# EAGLE design AMini3350 (EAGLE 9.5.2)
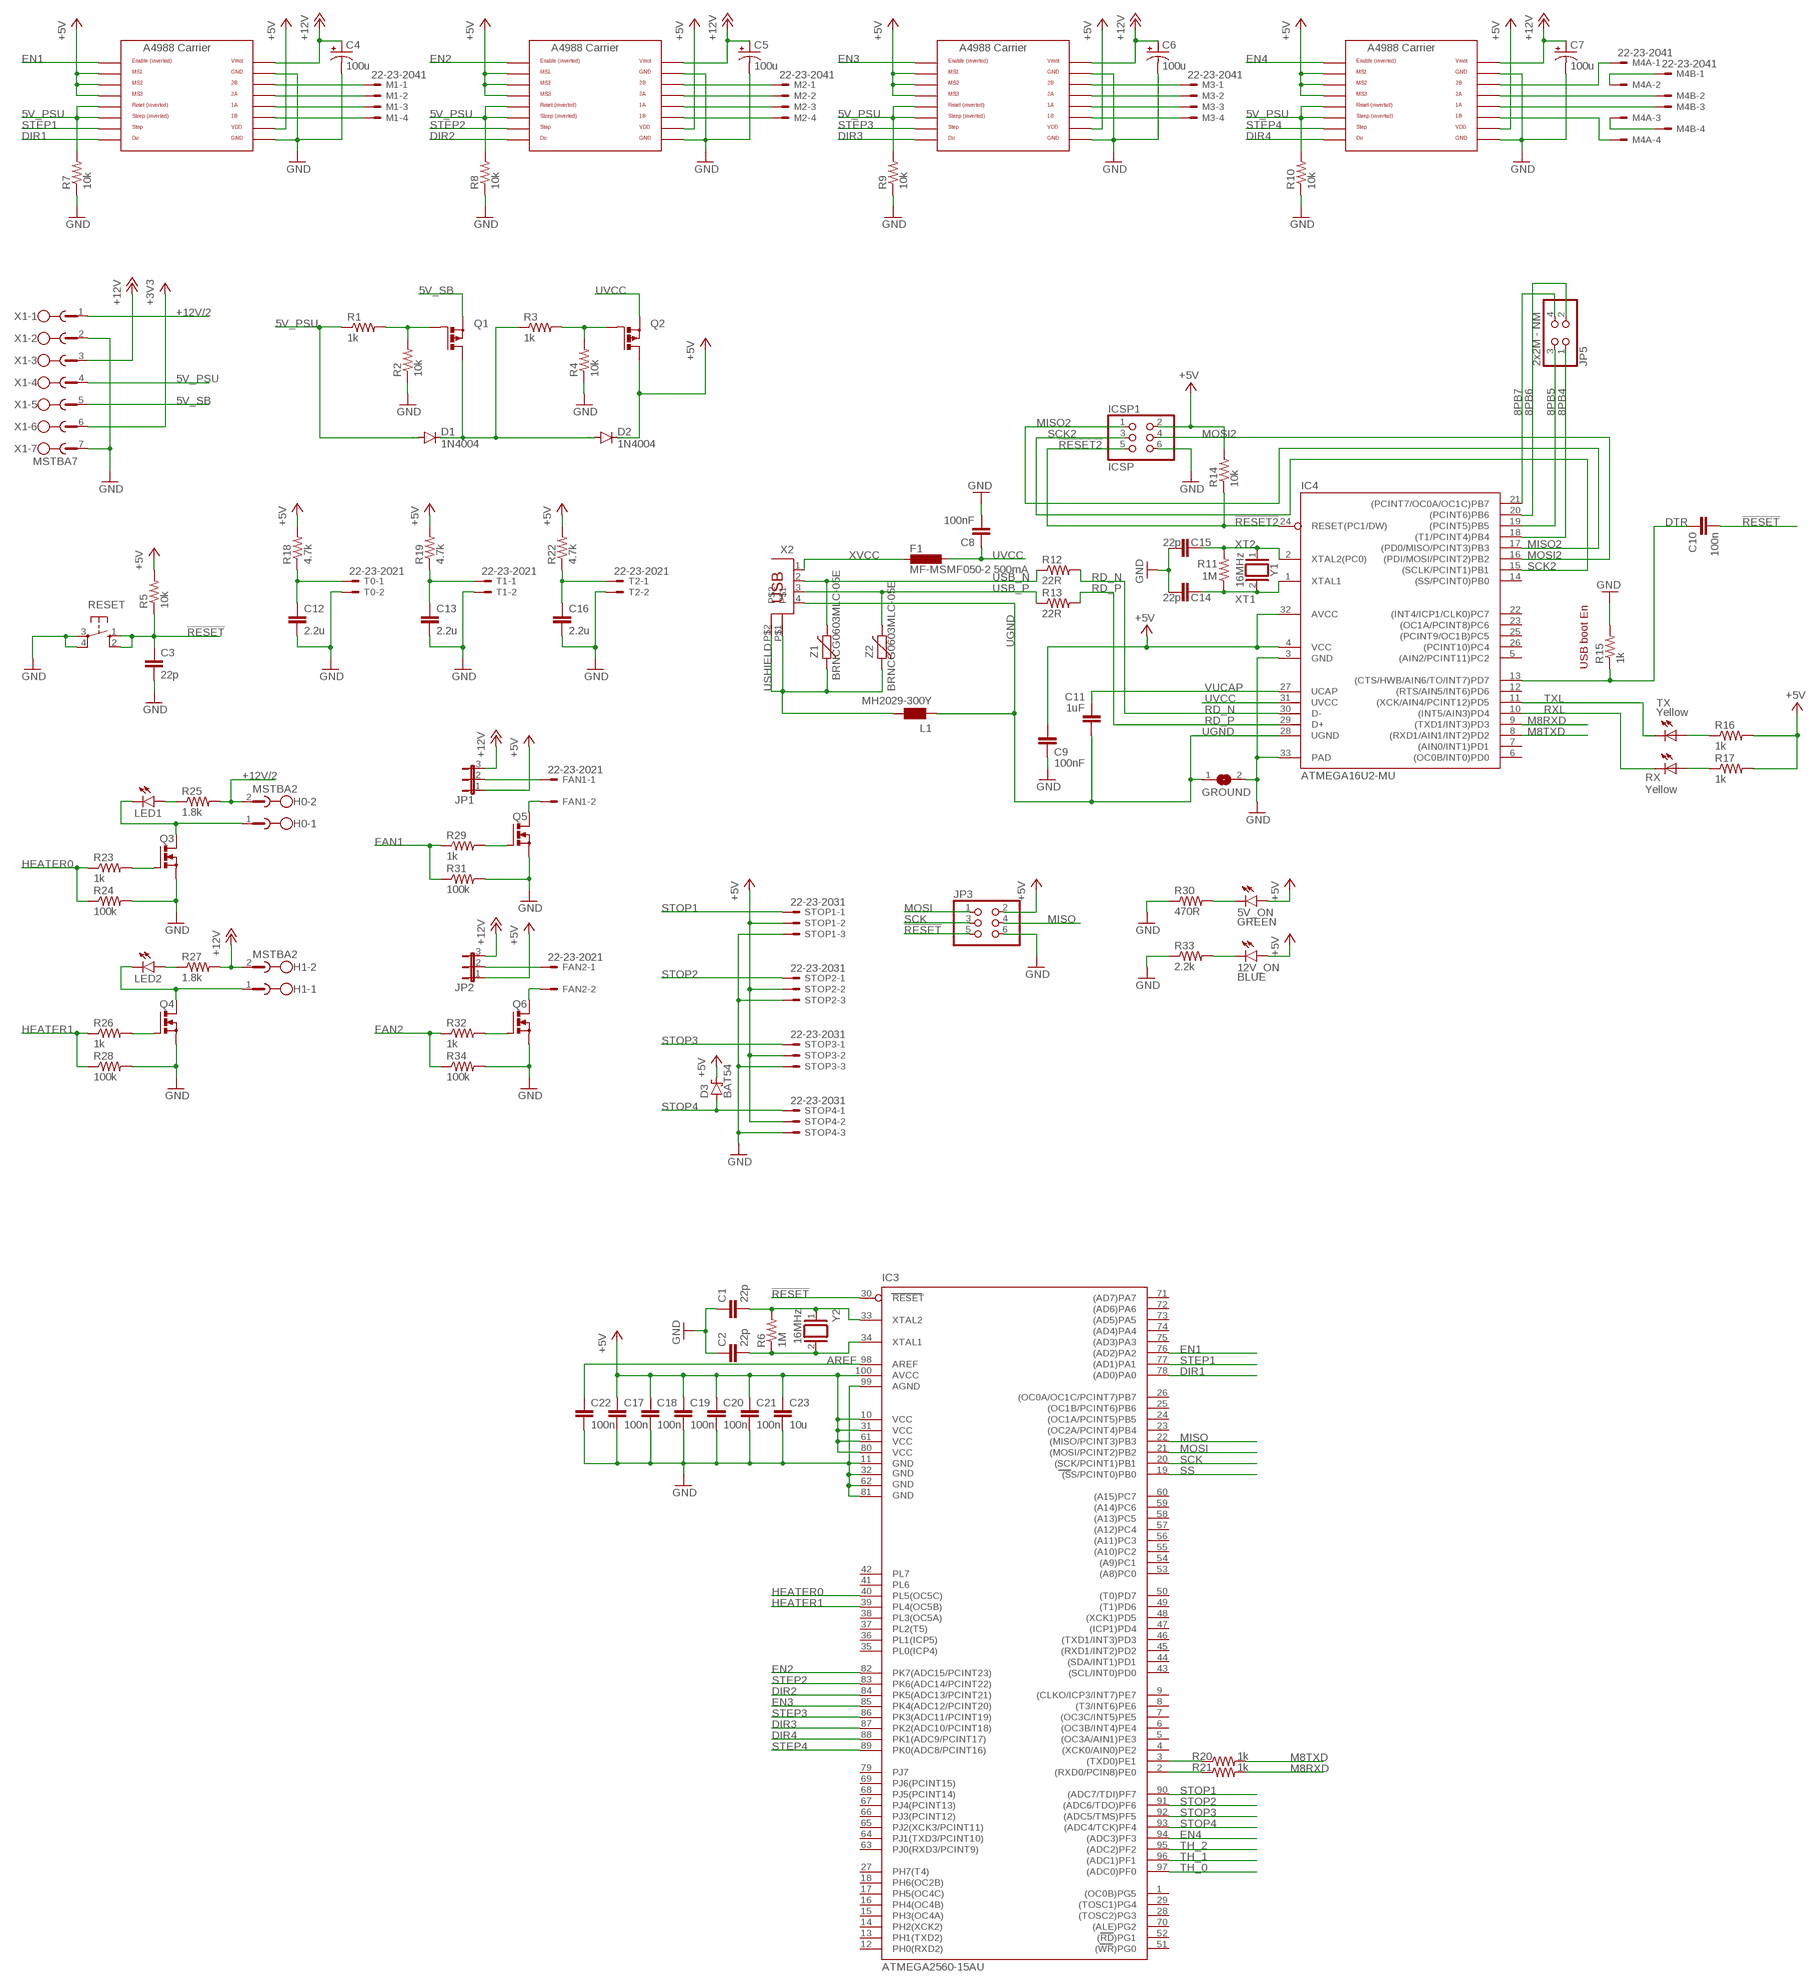
[diagram p0: schematic, sheet 1]

## Parts
5V_ON  GREEN  LEDCHIP-LED0805  [CHIP-LED0805]
12V_ON  BLUE  LEDCHIP-LED0805  [CHIP-LED0805]
C1  22p  C-EUC0603  [C0603]
C2  22p  C-EUC0603  [C0603]
C3  22p  C-EUC0603  [C0603]
C4  100u  CPOL-USD  [PANASONIC_D]
C5  100u  CPOL-USD  [PANASONIC_D]
C6  100u  CPOL-USD  [PANASONIC_D]
C7  100u  CPOL-USD  [PANASONIC_D]
C8  100nF  C-EUC0603  [C0603]
C9  100nF  C-EUC0603  [C0603]
C10  100n  C-EUC0603  [C0603]
C11  1uF  C-EUC0603  [C0603]
C12  2.2u  C-EUC0603  [C0603]
C13  2.2u  C-EUC0603  [C0603]
C14  22p  C-EUC0603  [C0603]
C15  22p  C-EUC0603  [C0603]
C16  2.2u  C-EUC0603  [C0603]
C17  100n  C-EUC0603  [C0603]
C18  100n  C-EUC0603  [C0603]
C19  100n  C-EUC0603  [C0603]
C20  100n  C-EUC0603  [C0603]
C21  100n  C-EUC0603  [C0603]
C22  100n  C-EUC0603  [C0603]
C23  10u  C-EUC0805  [C0805]
D1  1N4004  [DO41-10]
D2  1N4004  [DO41-10]
D3  BAT54  [SOT23]
F1  MF-MSMF050-2 500mA  0002_MF-MSMF050-2  [L1812]
FAN1  22-23-2021  [22-23-2021]
FAN2  22-23-2021  [22-23-2021]
GROUND  SJ  [SJ]
H0  MSTBA2  [MSTBA2]
H1  MSTBA2  [MSTBA2]
IC3  ATMEGA2560-15AU  0023_ATMEGA2560-16AU  [TQFP100]
IC4  ATMEGA16U2-MU  0007_ATMEGA16U2-MUR  [MLF32]
ICSP1  ICSP  0114_PH254-203DF118A00V  [2X03]
JP1  JP2E  [JP2]
JP2  JP2E  [JP2]
JP3  PINHD-2X3  [2X03]
JP5  2x2M - NM  PINHD-2X2  [2X02]
L1  MH2029-300Y  0001_BLM21PG300SN1D_/_MH2029-300Y  [0805]
LED1  LEDCHIP-LED0805  [CHIP-LED0805]
LED2  LEDCHIP-LED0805  [CHIP-LED0805]
M1  22-23-2041  [22-23-2041]
M2  22-23-2041  [22-23-2041]
M3  22-23-2041  [22-23-2041]
M4A  22-23-2041  [22-23-2041]
M4B  22-23-2041  [22-23-2041]
Q1  PMOSFET_PTO220BV  [TO220BV]
Q2  PMOSFET_PTO220BV  [TO220BV]
Q3  PMOSFET_NTO220BV  [TO220BV]
Q4  PMOSFET_NTO220BV  [TO220BV]
Q5  PMOSFET_NTO220BV  [TO220BV]
Q6  PMOSFET_NTO220BV  [TO220BV]
R1  1k  R-US_R0603  [R0603]
R2  10k  R-US_R0603  [R0603]
R3  1k  R-US_R0603  [R0603]
R4  10k  R-US_R0603  [R0603]
R5  10k  R-US_R0603  [R0603]
R6  1M  R-US_R0603  [R0603]
R7  10k  R-US_R0603  [R0603]
R8  10k  R-US_R0603  [R0603]
R9  10k  R-US_R0603  [R0603]
R10  10k  R-US_R0603  [R0603]
R11  1M  R-US_R0603  [R0603]
R12  22R  R-US_R0603  [R0603]
R13  22R  R-US_R0603  [R0603]
R14  10k  R-US_R0603  [R0603]
R15  1k  R-US_R0603  [R0603]
R16  1k  R-US_R0603  [R0603]
R17  1k  R-US_R0603  [R0603]
R18  4.7k  R-US_R0603  [R0603]
R19  4.7k  R-US_R0603  [R0603]
R20  1k  R-US_R0603  [R0603]
R21  1k  R-US_R0603  [R0603]
R22  4.7k  R-US_R0603  [R0603]
R23  1k  R-US_R0603  [R0603]
R24  100k  R-US_R0603  [R0603]
R25  1.8k  R-US_R0603  [R0603]
R26  1k  R-US_R0603  [R0603]
R27  1.8k  R-US_R0603  [R0603]
R28  100k  R-US_R0603  [R0603]
R29  1k  R-US_R0603  [R0603]
R30  470R  R-US_R0603  [R0603]
R31  100k  R-US_R0603  [R0603]
R32  1k  R-US_R0603  [R0603]
R33  2.2k  R-US_R0603  [R0603]
R34  100k  R-US_R0603  [R0603]
RESET  10-XX  [B3F-10XX]
RX  Yellow  0044_KPT-2012YC  [CHIPLED_0805]
STOP1  22-23-2031  [22-23-2031]
STOP2  22-23-2031  [22-23-2031]
STOP3  22-23-2031  [22-23-2031]
STOP4  22-23-2031  [22-23-2031]
T0  22-23-2021  [22-23-2021]
T1  22-23-2021  [22-23-2021]
T2  22-23-2021  [22-23-2021]
TX  Yellow  0044_KPT-2012YC  [CHIPLED_0805]
U$1  A4988BREAKOUT  [A4988BREAKOUT]
U$2  A4988BREAKOUT  [A4988BREAKOUT]
U$3  A4988BREAKOUT  [A4988BREAKOUT]
U$4  A4988BREAKOUT  [A4988BREAKOUT]
X1  MSTBA7  [MSTBA7]
X2  0056_USB-B-S-RA-WT-SPCC  [PN61729]
Y1  16MHz  0019_P011052006_16M  [QS]
Y2  16MHz  0019_P011052006_16M  [QS]
Z1  BRNCG0603MLC-05E  0010_BRNCG0603MLC-05E  [CT/CN0603]
Z2  BRNCG0603MLC-05E  0010_BRNCG0603MLC-05E  [CT/CN0603]

## Nets
1A-1: M1.3 U$1.1A
1A-2: M2.3 U$2.1A
1A-3: M3.3 U$3.1A
1A-4: M4B.3 U$4.1A
1B-1: M1.4 U$1.1B
1B-2: M2.4 U$2.1B
1B-3: M3.4 U$3.1B
1B-4: M4A.4 U$4.1B
2A-1: M1.2 U$1.2A
2A-2: M2.2 U$2.2A
2A-3: M3.2 U$3.2A
2A-4: M4B.2 U$4.2A
2B-1: M1.1 U$1.2B
2B-2: M2.1 U$2.2B
2B-3: M3.1 U$3.2B
2B-4: M4A.1 U$4.2B
5V_PSU: D1.A R1.1 R7.2 R8.2 R9.2 R10.2 U$1.RST U$1.SLP(SLEEP) U$2.RST U$2.SLP(SLEEP) U$3.RST U$3.SLP(SLEEP) U$4.RST U$4.SLP(SLEEP) X1.4
5V_SB: Q1.S X1.5
5V_SB_G: Q1.G R1.2 R2.2
5V_SEL1: D1.C D2.A Q1.D R3.1
8PB4: IC4.18((T1/PCINT4)PB4) JP5.1
8PB5: IC4.19((PCINT5)PB5) JP5.3
8PB6: IC4.20((PCINT6)PB6) JP5.2
8PB7: IC4.21((PCINT7/OC0A/OC1C)PB7) JP5.4
!RESET: C3.1 C10.2 IC3.30(RESET) JP3.5 R5.1 RESET.1(S) RESET.2(S1)
!RESET2: IC4.24(RESET(PC1/DW)) ICSP1.5 R14.1
+3V3: X1.6
+5V: 5V_ON.A 12V_ON.A C9.1 C17.1 C18.1 C19.1 C20.1 C21.1 C23.1 D2.C D3.3(C) IC3.10(VCC) IC3.31(VCC1) IC3.61(VCC2) IC3.80(VCC3) IC3.100(AVCC) IC4.4(VCC) IC4.32(AVCC) ICSP1.2 JP1.1 JP2.1 JP3.2 Q2.D R5.2 R14.2 R16.2 R17.2 R18.2 R19.2 R22.2 STOP1.2 STOP2.2 STOP3.2 STOP4.2 U$1.MS1 U$1.MS2 U$1.MS3 U$1.VDD U$2.MS1 U$2.MS2 U$2.MS3 U$2.VDD U$3.MS1 U$3.MS2 U$3.MS3 U$3.VDD U$4.MS1 U$4.MS2 U$4.MS3 U$4.VDD
+12V: C4.+ C5.+ C6.+ C7.+ H1.2 JP1.3 JP2.3 R27.2 U$1.VMOT U$2.VMOT U$3.VMOT U$4.VMOT X1.3
+12V/2: H0.2 R25.2 X1.1
AB1-4: M4A.3 M4B.4
AB2-4: M4A.2 M4B.1
AREF: C22.1 IC3.98(AREF)
DIR1: IC3.78((AD0)PA0) U$1.DIR
DIR2: IC3.84(PK5(ADC13/PCINT21)) U$2.DIR
DIR3: IC3.87(PK2(ADC10/PCINT18)) U$3.DIR
DIR4: IC3.88(PK1(ADC9/PCINT17)) U$4.DIR
DTR: C10.1 IC4.13((CTS/HWB/AIN6/TO/INT7)PD7) R15.1
EN1: IC3.76((AD2)PA2) U$1.EN
EN2: IC3.82(PK7(ADC15/PCINT23)) U$2.EN
EN3: IC3.85(PK4(ADC12/PCINT20)) U$3.EN
EN4: IC3.94((ADC3)PF3) U$4.EN
FAN1: R29.1 R31.1
FAN1_D: FAN1.2 Q5.D
FAN1_G: Q5.G R29.2
FAN1_V: FAN1.1 JP1.2
FAN2: R32.1 R34.1
FAN2_D: FAN2.2 Q6.D
FAN2_G: Q6.G R32.2
FAN2_V: FAN2.1 JP2.2
GND: C1.1 C2.1 C3.2 C4.- C5.- C6.- C7.- C8.2 C9.2 C12.2 C13.2 C14.2 C15.2 C16.2 C17.2 C18.2 C19.2 C20.2 C21.2 C22.2 C23.2 GROUND.2 IC3.11(GND) IC3.32(GND1) IC3.62(GND2) IC3.81(GND3) IC3.99(AGND) IC4.3(GND) IC4.33(PAD) ICSP1.6 JP3.6 Q3.S Q4.S Q5.S Q6.S R2.1 R4.1 R7.1 R8.1 R9.1 R10.1 R15.2 R24.2 R28.2 R30.1 R31.2 R33.1 R34.2 RESET.3(P) RESET.4(P1) STOP1.3 STOP2.3 STOP3.3 STOP4.3 T0.2 T1.2 T2.2 U$1.GND U$1.GND@0(GND) U$2.GND U$2.GND@0(GND) U$3.GND U$3.GND@0(GND) U$4.GND U$4.GND@0(GND) X1.2 X1.7
H0_D: H0.1 LED1.C Q3.D
H0_G: Q3.G R23.2
H0_LED: LED1.A R25.1
H1_D: H1.1 LED2.C Q4.D
H1_G: Q4.G R26.2
H1_LED: LED2.A R27.1
HEATER0: IC3.40(PL5(OC5C)) R23.1 R24.1
HEATER1: IC3.39(PL4(OC5B)) R26.1 R28.1
M8RXD: IC4.9((TXD1/INT3)PD3) R21.2
M8TXD: IC4.8((RXD1/AIN1/INT2)PD2) R20.2
MISO: IC3.22((MISO/PCINT3)PB3) JP3.4
MISO2: IC4.17((PD0/MISO/PCINT3)PB3) ICSP1.1
MOSI: IC3.21((MOSI/PCINT2)PB2) JP3.1
MOSI2: IC4.16((PDI/MOSI/PCINT2)PB2) ICSP1.4
N$1: 5V_ON.C R30.2
N$2: 12V_ON.C R33.2
RD_N: IC4.30(D-) R12.2
RD_P: IC4.29(D+) R13.2
RX_L: R17.1 RX.A
RXD: IC3.2((RXD0/PCIN8)PE0) R21.1
RXL: IC4.10((INT5/AIN3)PD4) RX.C
SCK: IC3.20((SCK/PCINT1)PB1) JP3.3
SCK2: IC4.15((SCLK/PCINT1)PB1) ICSP1.3
SS: IC3.19((SS/PCINT0)PB0)
STEP1: IC3.77((AD1)PA1) U$1.STEP
STEP2: IC3.83(PK6(ADC14/PCINT22)) U$2.STEP
STEP3: IC3.86(PK3(ADC11/PCINT19)) U$3.STEP
STEP4: IC3.89(PK0(ADC8/PCINT16)) U$4.STEP
STOP1: IC3.90((ADC7/TDI)PF7) STOP1.1
STOP2: IC3.91((ADC6/TDO)PF6) STOP2.1
STOP3: IC3.92((ADC5/TMS)PF5) STOP3.1
STOP4: D3.1(A) IC3.93((ADC4/TCK)PF4) STOP4.1
TH_0: C12.1 IC3.97((ADC0)PF0) R18.1 T0.1
TH_1: C13.1 IC3.96((ADC1)PF1) R19.1 T1.1
TH_2: C16.1 IC3.95((ADC2)PF2) R22.1 T2.1
TX_L: R16.1 TX.A
TXD: IC3.3((TXD0)PE1) R20.1
TXL: IC4.11((XCK/AIN4/PCINT12)PD5) TX.C
UGND: C11.2 GROUND.1 IC4.28(UGND) L1.1 X2.4
USB_N: R12.1 X2.2 Z1.2
USB_P: R13.1 X2.3 Z2.2
USHIELD [gnd]: L1.2 X2.P$1 X2.P$2 Z1.1 Z2.1
UVCC: C8.1 F1.1 IC4.31(UVCC) Q2.S
UVCC_G: Q2.G R3.2 R4.2
VUCAP: C11.1 IC4.27(UCAP)
XT1: C14.1 IC4.1(XTAL1) R11.1 Y1.2
XT2: C15.1 IC4.2(XTAL2(PC0)) R11.2 Y1.1
XTAL1: C2.2 IC3.34(XTAL1) R6.1 Y2.2
XTAL2: C1.2 IC3.33(XTAL2) R6.2 Y2.1
XVCC [power usb]: F1.2 X2.1
Unconnected: IC3.1((OC0B)PG5) IC3.4((XCK0/AIN0)PE2) IC3.5((OC3A/AIN1)PE3) IC3.6((OC3B/INT4)PE4) IC3.7((OC3C/INT5)PE5) IC3.8((T3/INT6)PE6) IC3.9((CLKO/ICP3/INT7)PE7) IC3.12(PH0(RXD2)) IC3.13(PH1(TXD2)) IC3.14(PH2(XCK2)) IC3.15(PH3(OC4A)) IC3.16(PH4(OC4B)) IC3.17(PH5(OC4C)) IC3.18(PH6(OC2B)) IC3.23((OC2A/PCINT4)PB4) IC3.24((OC1A/PCINT5)PB5) IC3.25((OC1B/PCINT6)PB6) IC3.26((OC0A/OC1C/PCINT7)PB7) IC3.27(PH7(T4)) IC3.28((TOSC2)PG3) IC3.29((TOSC1)PG4) IC3.35(PL0(ICP4)) IC3.36(PL1(ICP5)) IC3.37(PL2(T5)) IC3.38(PL3(OC5A)) IC3.41(PL6) IC3.42(PL7) IC3.43((SCL/INT0)PD0) IC3.44((SDA/INT1)PD1) IC3.45((RXD1/INT2)PD2) IC3.46((TXD1/INT3)PD3) IC3.47((ICP1)PD4) IC3.48((XCK1)PD5) IC3.49((T1)PD6) IC3.50((T0)PD7) IC3.51((WR)PG0) IC3.52((RD)PG1) IC3.53((A8)PC0) IC3.54((A9)PC1) IC3.55((A10)PC2) IC3.56((A11)PC3) IC3.57((A12)PC4) IC3.58((A13)PC5) IC3.59((A14)PC6) IC3.60((A15)PC7) IC3.63(PJ0(RXD3/PCINT9)) IC3.64(PJ1(TXD3/PCINT10)) IC3.65(PJ2(XCK3/PCINT11)) IC3.66(PJ3(PCINT12)) IC3.67(PJ4(PCINT13)) IC3.68(PJ5(PCINT14)) IC3.69(PJ6(PCINT15)) IC3.70((ALE)PG2) IC3.71((AD7)PA7) IC3.72((AD6)PA6) IC3.73((AD5)PA5) IC3.74((AD4)PA4) IC3.75((AD3)PA3) IC3.79(PJ7) IC4.5((AIN2/PCINT11)PC2) IC4.6((OC0B/INT0)PD0) IC4.7((AIN0/INT1)PD1) IC4.12((RTS/AIN5/INT6)PD6) IC4.14((SS/PCINT0)PB0) IC4.22((INT4/ICP1/CLK0)PC7) IC4.23((OC1A/PCINT8)PC6) IC4.25((PCINT9/OC1B)PC5) IC4.26((PCINT10)PC4)

## Notes on the sheet
- USB boot En

## Library data of the parts
5V_ON 12V_ON LED1 LED2 = led:LED: LED OSRAM: - CHIPLED LG R971, LG N971, LY N971, LG Q971, LY Q971, LO R971, LY R971 LH N974, LH R974 LS Q976, LO Q976, LY Q976 LO Q996 - Hyper CHIPLED LW Q18S LB Q993, LB Q99A, LB R99A - SideLED LS A670, LO A670, LY A670, LG A670, LP A670 LB A673, LV A673, LT A673, LW A673 LH A674 LY A675 LS A676, LA A676, LO A676, LY A676, LW A676 LS A679, LY A679, LG A679 - Hyper Micro SIDELED® LS Y876, LA Y876, LO Y876, LY Y876 LT Y87S - SmartLED LW L88C, LW L88S LB L89C, LB L89S, LG L890 LS L89K, LO L89K, LY L89K LS L896, LA L896, LO L896, LY L896 - TOPLED LS T670, LO T670, LY T670, LG T670, LP T670 LSG T670, LSP T670, LSY T670, LOP T670, LYG T670 LG T671, LOG T671, LSG T671 LB T673, LV T673, LT T673, LW T673 LH T674 LS T676, LA T676, LO T676, LY T676, LB T676, LH T676, LSB T676, LW T676 LB T67C, LV T67C, LT T67C, LS T67K, LO T67K, LY T67K, LW E67C LS E67B, LA E67B, LO E67B, LY E67B, LB E67C, LV E67C, LT E67C LW T67C LS T679, LY T679, LG T679 LS T770, LO T770, LY T770, LG T770, LP T770 LB T773, LV T773, LT T773, LW T773 LH T774 LS E675, LA E675, LY E675, LS T675 LS T776, LA T776, LO T776, LY T776, LB T776 LHGB T686 LT T68C, LB T68C - Hyper Mini TOPLED® LB M676 - Mini TOPLED Santana® LG M470 LS M47K, LO M47K, LY M47K Source: http://www.osram.convergy.de LUXEON: - LUMILED® LXK2-PW12-R00, LXK2-PW12-S00, LXK2-PW14-U00, LXK2-PW14-V00 LXK2-PM12-R00, LXK2-PM12-S00, LXK2-PM14-U00 LXK2-PE12-Q00, LXK2-PE12-R00, LXK2-PE12-S00, LXK2-PE14-T00, LXK2-PE14-U00 LXK2-PB12-K00, LXK2-PB12-L00, LXK2-PB12-M00, LXK2-PB14-N00, LXK2-PB14-P00, LXK2-PB14-Q00 LXK2-PR12-L00, LXK2-PR12-M00, LXK2-PR14-Q00, LXK2-PR14-R00 LXK2-PD12-Q00, LXK2-PD12-R00, LXK2-PD12-S00 LXK2-PH12-R00, LXK2-PH12-S00 LXK2-PL12-P00, LXK2-PL12-Q00, LXK2-PL12-R00 Source: www.luxeon.com KINGBRIGHT: KA-3528ASYC Source: www.kingbright.com
C1-C3 C8-C23 = rcl:C-EU: CAPACITOR, European symbol; SPICEPREFIX: C
C4-C7 = rcl:CPOL-US: POLARIZED CAPACITOR, American symbol; SPICEPREFIX: C
D1 D2 = diode:1N4004: DIODE general purpose rectifier, 1 A
D3 = diode:BAT54: Schottky Diodes Source: Fairchild .. BAT54.pdf
F1 = Protezione:0002_MF-MSMF050-2: 500 mA Multifuse � Polyfuse; MONTHLY_USAGE: _____; PART_NUMBER: MF-MSMF050-2; PRICE: _____; SUPPLIER: _____; TYPE: Protezione
FAN1 FAN2 T0 T1 T2 = con-molex:22-23-2021: .100" (2.54mm) Center Header - 2 Pin; MF: MOLEX; MPN: 22-23-2021; OC_FARNELL: 1462926; OC_NEWARK: 25C3832
GROUND = jumper:SJ: SMD solder JUMPER
H0 H1 = con-phoenix-508:MSTBA2: PHOENIX; MF: FARNELL; MPN: 1757242; OC_FARNELL: 3705171; OC_NEWARK: 71C4161
IC3 = IntegratedCircuits:0023_ATMEGA2560-16AU: 8-bit Microcontroller with 256K Bytes In-System Programmable Flash - ATMEGA2560-16AU; CASE: TQFP100_14x14; MONTHLY_USAGE: _____; PART_NUMBER: ATMEGA2560-16AU; PRICE: _____; SUPPLIER: _____; TYPE: Circuito_Integrato
IC4 = IntegratedCircuits:0007_ATMEGA16U2-MUR: 8-bit Microcontroller with 16K Bytes of ISP Flash and USB Controller ATMEGA16U2-MUR; CASE: QFN32_5x5; MONTHLY_USAGE: _____; PART_NUMBER: ATMEGA16U2-MUR; PRICE: _____; SUPPLIER: _____; TYPE: Circuito_Integrato
ICSP1 = Connettori:0114_PH254-203DF118A00V: 3x2 M V h 8,5 mm p2,54; MONTHLY_USAGE: _____; PART_NUMBER: PH254-203DF118A00V; PRICE: _____; SUPPLIER: _____; TYPE: Connettori
JP1 JP2 = jumper:JP2E: JUMPER
JP3 = pinhead:PINHD-2X3: PIN HEADER
JP5 = SmartPrj:PINHD-2X2: PIN HEADER
L1 = Protezione:0001_BLM21PG300SN1D_/_MH2029-300Y: BLM21; MONTHLY_USAGE: _____; PART_NUMBER: BLM21PG300SN1D_/_MH2029-300Y; PRICE: _____; SUPPLIER: _____; TYPE: Protezione
M1-M3 M4A M4B = con-molex:22-23-2041: .100" (2.54mm) Center Header - 4 Pin; MF: MOLEX; MPN: 22-23-2041; OC_FARNELL: 1462920; OC_NEWARK: 38C0355
Q1 Q2 = transistor-power:PMOSFET_P: Power MOSFET P-Channel
Q3-Q6 = transistor-power:PMOSFET_N: Power MOSFET N-Channel
R1-R34 = rcl:R-US_: RESISTOR, American symbol; SPICEPREFIX: R
RESET = switch-omron:10-XX: OMRON SWITCH; MPN: B3F-1000; OC_FARNELL: 176432; OC_NEWARK: 36M3542
RX TX = Opto:0044_KPT-2012YC: LED YELLOW - SMD - 0805; MONTHLY_USAGE: _____; PART_NUMBER: KPT-2012YC; PRICE: _____; SUPPLIER: _____; TYPE: Opto
STOP1-STOP4 = con-molex:22-23-2031: .100" (2.54mm) Center Header - 3 Pin; MF: MOLEX; MPN: 22-23-2031; OC_FARNELL: 1462950; OC_NEWARK: 30C0862
U$1-U$4 = RepRapjr:A4988BREAKOUT
X1 = con-phoenix-508:MSTBA7: PHOENIX; OC_FARNELL: unknown; OC_NEWARK: unknown
X2 = Connettori:0056_USB-B-S-RA-WT-SPCC: USB - B; MONTHLY_USAGE: _____; PART_NUMBER: USB-B-S-RA-WT-SPCC; PRICE: _____; SUPPLIER: _____; TYPE: Connettori
Y1 Y2 = Cristalli:0019_P011052006_16M: 16MHz THT; PART_NUMBER: P011052006 16M/FTX16M20S; TYPE: Cristalli
Z1 Z2 = Protezione:0010_BRNCG0603MLC-05E: CG0603MLC-05E; MONTHLY_USAGE: _____; PART_NUMBER: BRNCG0603MLC-05E; PRICE: _____; SUPPLIER: _____; TYPE: Protezione

## Net classes
2 gnd: width 0.305 mm, drill 0.406 mm, clearance 0.203 mm
3 power usb: width 0.2 mm, drill 0.406 mm, clearance 0.203 mm

## Board
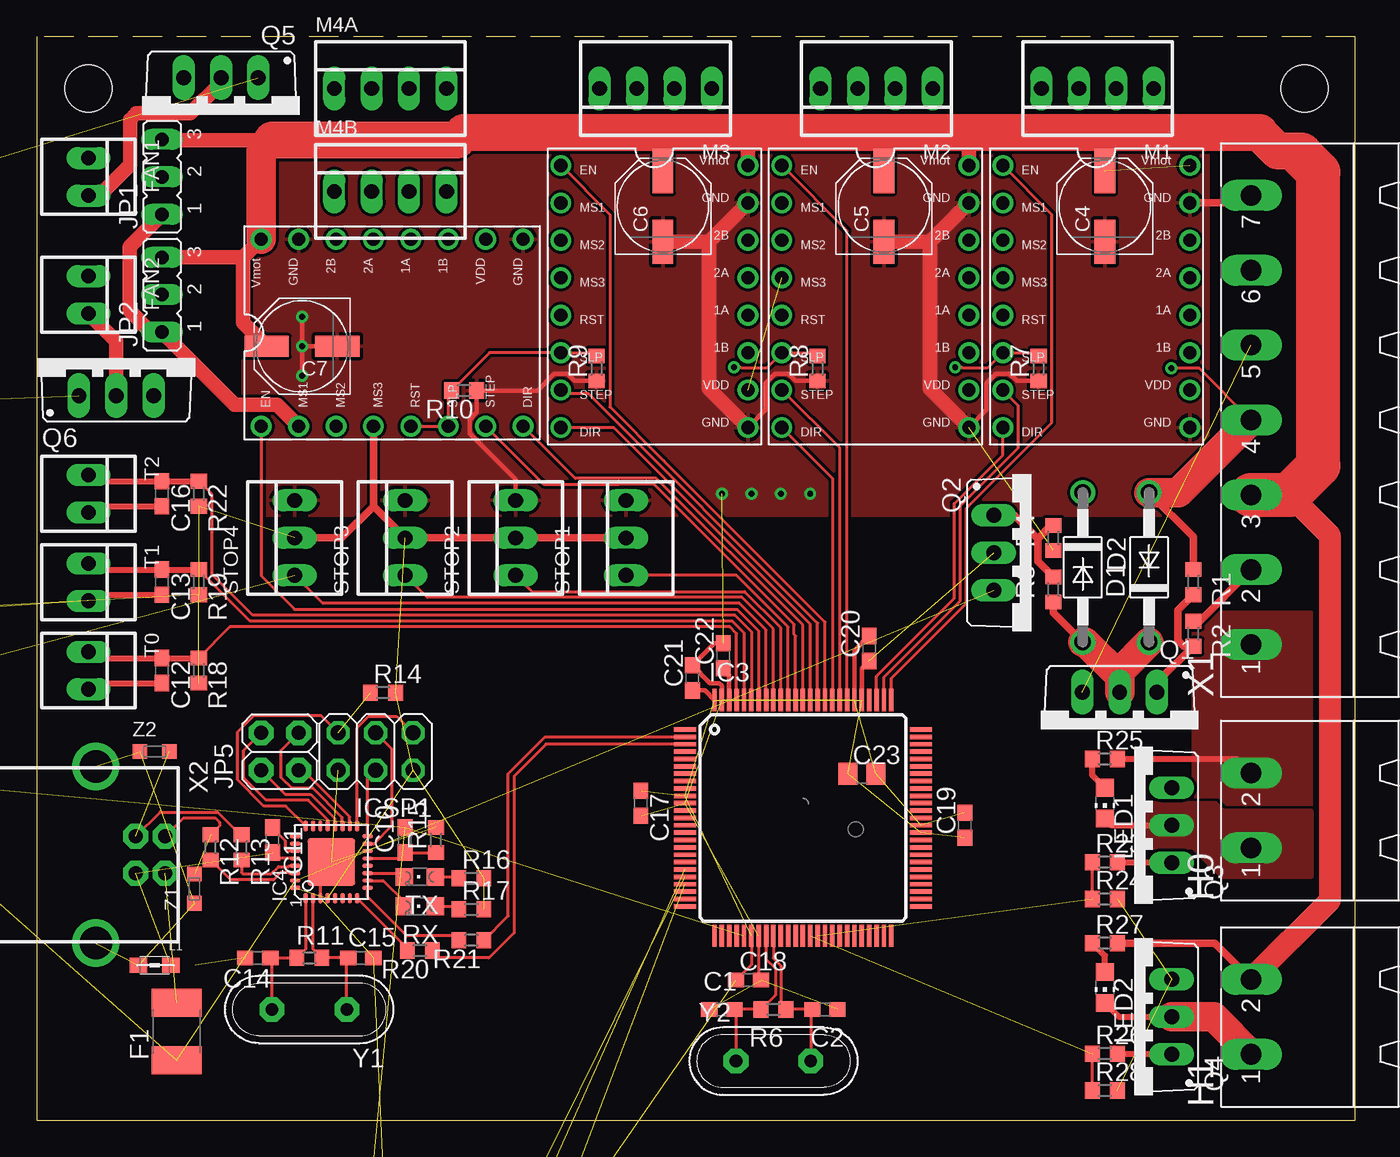
[diagram p1: board, top side]
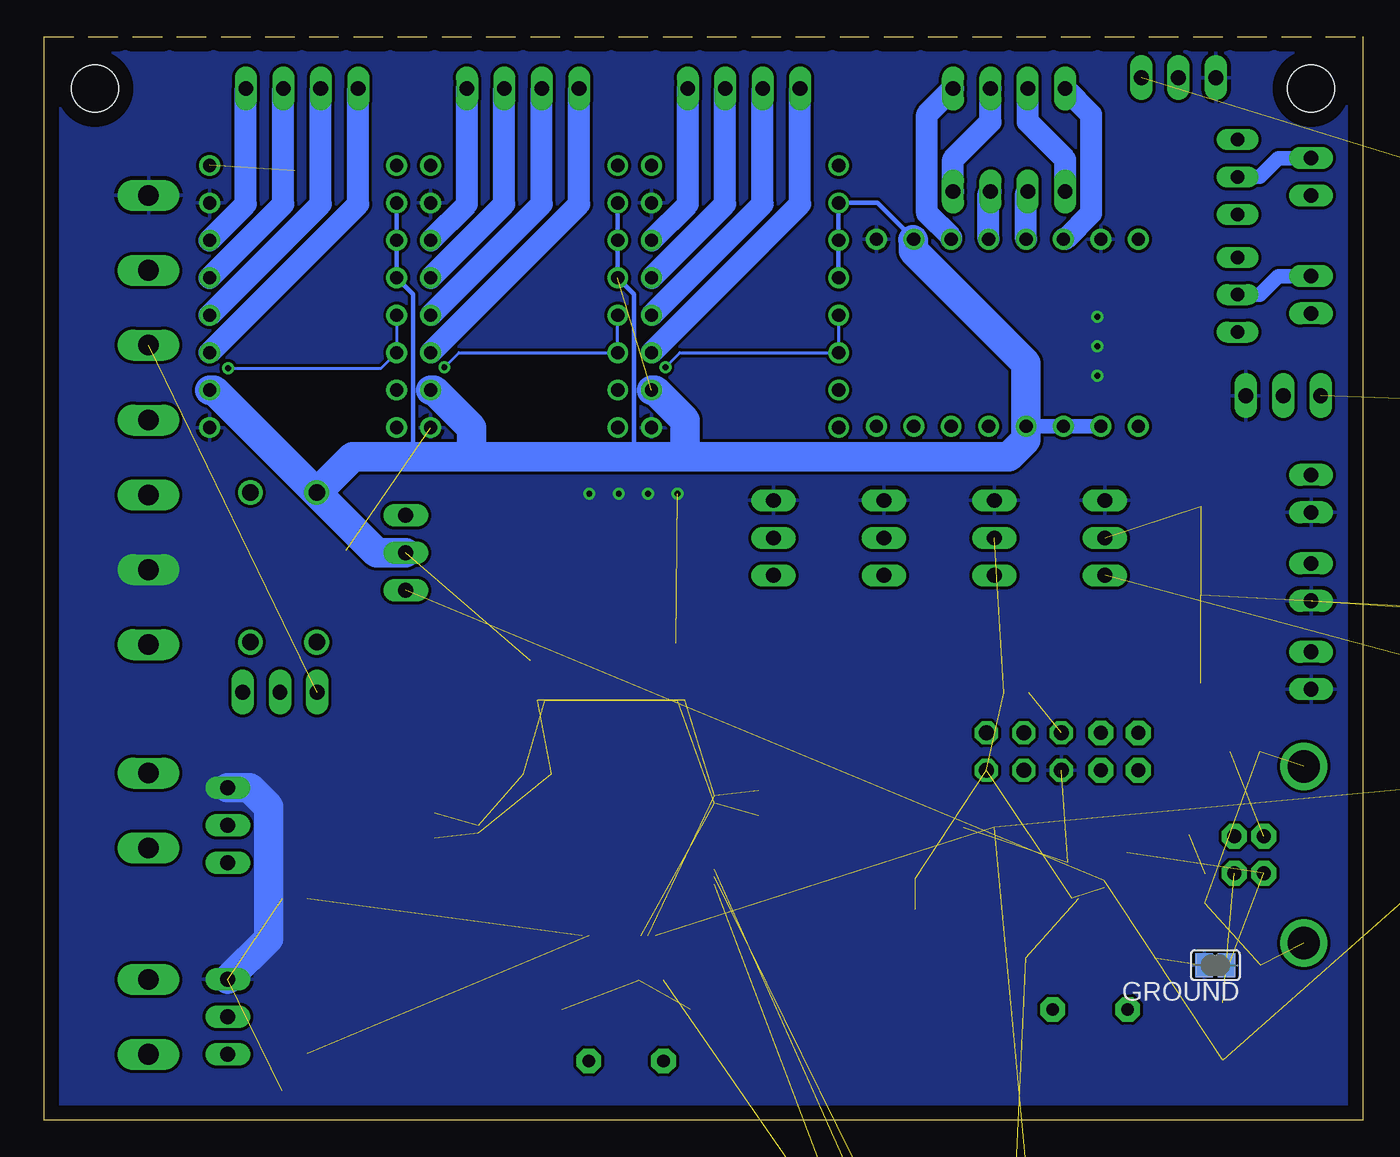
[diagram p2: board, bottom side, seen from below]

Size 89.5 x 73.5 mm. Coordinates in mm from the lower left corner, seen from the top.
Outline: 0,0 89.5,0 89.5,73.5 0,73.5 0,0
Copper layers (1*16): Top 0.035mm / dielectric 1.5mm / Bottom 0.035mm
Design rules "default *": minimum track width 0.2mm, minimum drill 0.4mm, track to track 0.2mm, track to pad 0.25mm, pad to pad 0.25mm, via to via 0.2mm, smd to smd 0.2mm, copper to edge 1mm, drill to drill 0.2mm, minimum pad ring 10mil, minimum via ring 8mil, stop-mask expansion 4mil, vias tented up to drill 16mil, thermal gap 10mil
Holes 3.2 mm at 86.05,70 3.5,70
tRestrict: area 83,67 to 89,73; area 0.5,67 to 6.5,73

### Footprints (pad centres in the part's own frame; a part is rotated, then mirrored left to right if it is on the bottom)
CHIP-LED0805 = smd 1.2 x 1.2: A 0,-1.05; C 0,1.05
C0603 = smd 1.1 x 1: 1 -0.85,0; 2 0.85,0
PANASONIC_D = smd 3 x 1.4: + 2.4,0; - -2.4,0
C0805 = smd 1.3 x 1.5: 1 -0.95,0; 2 0.95,0
DO41-10 = drill 1.118: A 5.08,0; C -5.08,0
SOT23 = smd 1 x 1.4: 1 -0.95,-1.1; 2 0.95,-1.1; 3 0,1.1
L1812 = smd 1.9 x 3.4: 1 -1.95,0; 2 1.95,0
22-23-2021 = drill 1 long: 1 -1.27,0; 2 1.27,0
SJ = smd 1.168 x 1.6: 1 -0.762,0; 2 0.762,0
MSTBA2 = drill 1.397 long: 1 -2.54,5.08; 2 2.54,5.08
TQFP100 = smd 1.5 x 0.3: 1 -8,6; 2 -8,5.5; 3 -8,5; 4 -8,4.5; 5 -8,4; 6 -8,3.5; 7 -8,3; 8 -8,2.5; 9 -8,2; 10 -8,1.5; 11 -8,1; 12 -8,0.5; 13 -8,0; 14 -8,-0.5; 15 -8,-1; 16 -8,-1.5; 17 -8,-2; 18 -8,-2.5; 19 -8,-3; 20 -8,-3.5; 21 -8,-4; 22 -8,-4.5; 23 -8,-5; 24 -8,-5.5; 25 -8,-6; 51 8,-6; 52 8,-5.5; 53 8,-5; 54 8,-4.5; 55 8,-4; 56 8,-3.5; 57 8,-3; 58 8,-2.5; 59 8,-2; 60 8,-1.5; 61 8,-1; 62 8,-0.5; 63 8,0; 64 8,0.5; 65 8,1; 66 8,1.5; 67 8,2; 68 8,2.5; 69 8,3; 70 8,3.5; 71 8,4; 72 8,4.5; 73 8,5; 74 8,5.5; 75 8,6 | smd 0.3 x 1.5: 26 -6,-8; 27 -5.5,-8; 28 -5,-8; 29 -4.5,-8; 30 -4,-8; 31 -3.5,-8; 32 -3,-8; 33 -2.5,-8; 34 -2,-8; 35 -1.5,-8; 36 -1,-8; 37 -0.5,-8; 38 0,-8; 39 0.5,-8; 40 1,-8; 41 1.5,-8; 42 2,-8; 43 2.5,-8; 44 3,-8; 45 3.5,-8; 46 4,-8; 47 4.5,-8; 48 5,-8; 49 5.5,-8; 50 6,-8; 76 6,8; 77 5.5,8; 78 5,8; 79 4.5,8; 80 4,8; 81 3.5,8; 82 3,8; 83 2.5,8; 84 2,8; 85 1.5,8; 86 1,8; 87 0.5,8; 88 0,8; 89 -0.5,8; 90 -1,8; 91 -1.5,8; 92 -2,8; 93 -2.5,8; 94 -3,8; 95 -3.5,8; 96 -4,8; 97 -4.5,8; 98 -5,8; 99 -5.5,8; 100 -6,8
MLF32 = smd 0.7 x 0.28: 1 -2.45,1.75; 2 -2.45,1.25; 3 -2.45,0.75; 4 -2.45,0.25; 5 -2.45,-0.25; 6 -2.45,-0.75; 7 -2.45,-1.25; 8 -2.45,-1.75; 17 2.45,-1.75; 18 2.45,-1.25; 19 2.45,-0.75; 20 2.45,-0.25; 21 2.45,0.25; 22 2.45,0.75; 23 2.45,1.25; 24 2.45,1.75 | smd 0.28 x 0.7: 9 -1.75,-2.45; 10 -1.25,-2.45; 11 -0.75,-2.45; 12 -0.25,-2.45; 13 0.25,-2.45; 14 0.75,-2.45; 15 1.25,-2.45; 16 1.75,-2.45; 25 1.75,2.45; 26 1.25,2.45; 27 0.75,2.45; 28 0.25,2.45; 29 -0.25,2.45; 30 -0.75,2.45; 31 -1.25,2.45; 32 -1.75,2.45 | smd 3.254 x 3.254: 33 0,0
2X03 = drill 1.016 pad 1.55 octagon: 1 -2.54,-1.27; 2 -2.54,1.27; 3 0,-1.27; 4 0,1.27; 5 2.54,-1.27; 6 2.54,1.27
JP2 = drill 0.914 long: 1 -2.54,0; 2 0,0; 3 2.54,0
2X03' = drill 1.016 octagon: 1 -2.54,-1.27; 2 -2.54,1.27; 3 0,-1.27; 4 0,1.27; 5 2.54,-1.27; 6 2.54,1.27
2X02 = drill 0.95 pad 1.676 octagon: 1 -1.27,-1.27; 2 -1.27,1.27; 3 1.27,-1.27; 4 1.27,1.27
0805 = smd 1.2 x 1: 1 -1.1,0; 2 1.1,0
22-23-2041 = drill 1 long: 1 -3.81,0; 2 -1.27,0; 3 1.27,0; 4 3.81,0
TO220BV = drill 1.016 long: D 0,-2.54; G -2.54,-2.54; S 2.54,-2.54
R0603 = smd 1 x 1.1: 1 -0.85,0; 2 0.85,0
B3F-10XX = drill 1.016 long: 1 -3.251,2.261; 2 3.251,2.261; 3 -3.251,-2.261; 4 3.251,-2.261
CHIPLED_0805 = smd 1.2 x 1.2: A 0,-1.05; C 0,1.05
22-23-2031 = drill 1 long: 1 -2.54,0; 2 0,0; 3 2.54,0
A4988BREAKOUT = drill 0.9: 1A 8.89,1.27; 1B 11.43,1.27; 2A 6.35,1.27; 2B 3.81,1.27; DIR 16.51,-11.43; EN -1.27,-11.43; GND 16.51,1.27; GND@0 1.27,1.27; MS1 1.27,-11.43; MS2 3.81,-11.43; MS3 6.35,-11.43; RST 8.89,-11.43; SLP 11.43,-11.43; STEP 13.97,-11.43; VDD 13.97,1.27; VMOT -1.27,1.27
MSTBA7 = drill 1.397 long: 1 -15.24,5.08; 2 -10.16,5.08; 3 -5.08,5.08; 4 0,5.08; 5 5.08,5.08; 6 10.16,5.08; 7 15.24,5.08
PN61729 = drill 0.95 pad 1.676 octagon: 1 1.25,4.71; 2 -1.25,4.71; 3 -1.25,2.71; 4 1.25,2.71 | drill 2.2: P$1 -6,0; P$2 6,0
QS = drill 0.85 pad 1.676 octagon: 1 -2.54,0; 2 2.54,0
CT/CN0603 = smd 1 x 1: 1 -1,0; 2 1,0

### Placement (x,y rotation side)
5V_ON  -110.5,-21.5 0 top  (outside the outline)
12V_ON  -110.5,-35.5 0 top  (outside the outline)
C1  46.5,7.5 0 top
C2  53.5,7.5 180 top
C3  23,-10.5 0 top  (outside the outline)
C4  72.5,62 90 top
C5  57.5,62 90 top
C6  42.5,62 90 top
C7  18,52.5 180 top
C8  -23,33.5 0 top  (outside the outline)
C9  -28,33.5 0 top  (outside the outline)
C10  25,19 90 top
C11  16,19 270 top
C12  8.5,30.5 270 top
C13  8.5,36.5 270 top
C14  15,11 180 top
C15  22,11 0 top
C16  8.5,42.5 270 top
C17  41,21.5 270 top
C18  48.3,9.5 0 top
C19  63,20 90 top
C20  56.5,32 90 top
C21  44.5,30 90 top
C22  46.6,31.5 90 top
C23  56,23.5 0 top
D1  75.5,37.5 90 top
D2  71,37.5 270 top
D3  -50.5,19.5 0 top  (outside the outline)
F1  9.5,6 90 top
FAN1  3.5,64 270 top
FAN2  3.5,56 270 top
GROUND  10,10.5 180 bottom
H0  87.5,21 90 top
H1  87.5,7 90 top
IC3  52,20.5 0 top
IC4  20,17.5 90 top
ICSP1  23,25 180 top
JP1  8.5,64 90 top
JP2  8.5,56 90 top
JP3  [2X03']  31,-15 270 top  (outside the outline)
JP5  16.5,25 90 top
L1  8,10.5 180 top
LED1  72.5,21.5 180 top
LED2  72.5,9 180 top
M1  72,70 180 top
M2  57,70 180 top
M3  42,70 180 top
M4A  24,70 0 top
M4B  24,63 0 top
Q1  73.5,26.5 180 top
Q2  67.5,38.5 270 top
Q3  74.5,20 90 top
Q4  74.5,7 90 top
Q5  12.5,68.2 180 top
Q6  5.4,51.7 0 top
R1  78.5,36.5 270 top
R2  78.5,33 270 top
R3  69,36 90 top
R4  69,39.5 90 top
R5  -57,27.5 0 top  (outside the outline)
R6  50,7.5 180 top
R7  68,51 90 top
R8  53,51 90 top
R9  38,51 90 top
R10  29,49.5 180 top
R11  18.5,11 0 top
R12  11.8,18.5 270 top
R13  13.9,18.5 270 top
R14  23.5,29 0 top
R15  27.1,19 90 top
R16  29.5,16.4 0 top
R17  29.5,14.3 0 top
R18  11,30.5 270 top
R19  11,36.5 270 top
R20  26,11.5 180 top
R21  29.5,12.2 180 top
R22  11,42.5 270 top
R23  72.5,17.5 0 top
R24  72.5,15 0 top
R25  72.5,24.5 0 top
R26  72.5,4.5 0 top
R27  72.5,12 0 top
R28  72.5,2 0 top
R29  -64.5,46.5 0 top  (outside the outline)
R30  -112,-26.5 0 top  (outside the outline)
R31  -45.5,41.5 0 top  (outside the outline)
R32  -69.5,46.5 0 top  (outside the outline)
R33  -112,-40 0 top  (outside the outline)
R34  -52,41.5 0 top  (outside the outline)
RESET  22.5,-15 0 top  (outside the outline)
RX  26,14.5 90 top
STOP1  40,39.5 90 top
STOP2  32.5,39.5 90 top
STOP3  25,39.5 90 top
STOP4  17.5,39.5 90 top
T0  3.5,30.5 270 top
T1  3.5,36.5 270 top
T2  3.5,42.5 270 top
TX  26,16.5 90 top
U$1  77,63.5 270 top
U$2  62,63.5 270 top
U$3  47,63.5 270 top
U$4  16.5,58.5 0 top
X1  87.5,47.5 90 top
X2  4,18 270 top
Y1  18.5,7.5 180 top
Y2  50,4 0 top
Z1  10.7,15.7 90 top
Z2  8,25 0 top

### Tracks (layer width: path | path; a pad name or v marks a point on that pad's centre or on a via)
1A-1
  Bottom 1.5: U$1.1A 70.73,62.15 M1.3
1A-2
  Bottom 1.5: U$2.1A 55.73,62.15 M2.3
1A-3
  Bottom 1.5: U$3.1A 40.73,62.15 M3.3
1A-4
  Bottom 1.5: U$4.1A 25.39,62.88 M4B.3
1B-1
  Bottom 1.5: U$1.1B 68.19,62.15 M1.4
1B-2
  Bottom 1.5: U$2.1B 53.19,62.15 M2.4
1B-3
  Bottom 1.5: U$3.1B 38.19,62.15 M3.4
1B-4
  Bottom 1.5: U$4.1B 27.93,59.88 29.56,61.52 29.56,68.25 M4A.4
2A-1
  Bottom 1.5: U$1.2A 73.27,62.15 M1.2
2A-2
  Bottom 1.5: U$2.2A 58.27,62.15 M2.2
2A-3
  Bottom 1.5: U$3.2A 43.27,62.15 M3.2
2A-4
  Bottom 1.5: U$4.2A 22.85,62.88 M4B.2
2B-1
  Bottom 1.5: U$1.2B 75.81,62.15 M1.1
2B-2
  Bottom 1.5: U$2.2B 60.81,62.15 M2.1
2B-3
  Bottom 1.5: U$3.2B 45.81,62.15 M3.1
2B-4
  Bottom 1.5: M4A.1 18.44,68.25 18.44,61.52 20.18,59.77 U$4.2B
5V_PSU  (via drill 0.4)
  Top 0.2: v47.34,51.09 47.76,51.09 47.83,51.02 49.52,51.02 U$2.SLP 52.78,52.07 R8.2 | v62.34,51.09 62.76,51.09 62.83,51.02 64.52,51.02 U$1.SLP 67.78,52.07 R7.2 | U$4.RST U$4.SLP 27.93,49.28 R10.2 30.72,52.07 U$3.SLP 37.78,52.07 R9.2 | X1.4 78.9,51.02 v77,51.02
  Top 0.5: R1.1 78.5,39.58 D1.A
  Top 2: X1.4 77.5,42.58 D1.A
  Bottom 0.2: U$3.RST U$3.SLP 46.35,52.07 v47.34,51.09 | U$2.RST U$2.SLP 61.35,52.07 v62.34,51.09 | U$1.RST U$1.SLP 66.62,51.02 v77,51.02
5V_SB  (1 unrouted)
5V_SB_G
  Top 0.5: Q1.G 76.04,29.69 R2.2 77.85,32.15 77.45,32.55 77.45,34.6 R1.2
5V_SEL1
  Top 0.5: D2.A 69,34.42 R3.1
  Top 2: Q1.D 73.5,30.11 | D2.A 71.19,32.42 73.5,30.11 | D1.C 73.5,30.42 73.5,30.11
8PB4
  Top 0.2: IC4.18 21.24,20.58 18.09,23.73 JP5.1
8PB5
  Top 0.2: IC4.19 20.74,20.51 18.75,22.5 17.32,22.5 16.58,23.24 16.58,25.08 JP5.3
8PB6
  Top 0.2: IC4.20 20.24,20.45 18.59,22.1 16.86,22.1 JP5.2
8PB7
  Top 0.2: JP5.4 14.04,25.08 14.04,23.24 15.58,21.7 18.42,21.7 19.74,20.38 IC4.21
!RESET  (6 unrouted)
!RESET2  (1 unrouted)
  Top 0.2: IC4.24 16.9,21.3 15.41,21.3 13.64,23.07 13.64,26.36 14.74,27.46 19.27,27.46 ICSP1.5
+5V  (24 unrouted)
  Top 0.2: IC3.31 48.5,10.55 C18.1
  Top 0.3: IC3.100 45.35,29.15 C21.1 | IC3.80 56,30.65 C20.1
  Top 0.5: U$4.MS3 22.85,41.65 | 22.85,41.65 STOP3.2 STOP2.2 STOP1.2 | 22.85,41.65 20.7,39.5 STOP4.2
  Top 1: JP1.1 6.3,59.26 6.3,54.9 7.74,53.46 JP2.1 13.44,48.52 16.32,48.52 U$4.MS1
  Bottom 0.3: U$3.MS3 U$3.MS2 U$3.MS1 32.93,62.23 U$4.VDD | U$2.MS1 U$2.MS2 U$2.MS3 49.47,56.05 49.47,45.03 49.5,45 | U$1.MS1 U$1.MS2 U$1.MS3 64.47,56.05 64.47,45.03 64.5,45
  Bottom 1: U$4.VDD 30.5,59.74 30.5,59.7 | U$4.MS3 U$4.MS2 U$4.MS1
  Bottom 2: D2.C 77.95,49.53 U$1.VDD | D2.C 68.58,45 64.5,45 60.5,45 | 60.5,45 49.5,45 24,45 22.85,46.15 U$4.MS3 22.85,51.35 30.5,59 30.5,59.7 30.52,59.72 | 46,45.5 46,47.48 48.05,49.53 U$3.VDD | 60.5,45 60.5,46.98 63.05,49.53 U$2.VDD | Q2.D 66.92,38.5 D2.C
+12V  (1 unrouted)
  Top 0.5: R27.2 79.96,12 H1.2
  Top 1: 16,66.5 8.54,66.5 JP1.3 | JP2.3 14,58.54 | 14,58.54 U$4.VMOT | C6.+ 42.5,66.99 | U$3.VMOT 48.27,66.76 48.5,66.99 | C5.+ 57.5,66.99 | U$2.VMOT 63.27,66.26 64,66.99 | C4.+ 72.5,65.99 73.5,66.99 | C7.+ 14,54.1 14,58.54
  Top 1.5: 85.02,42.42 87.75,39.69 87.75,14.87 H1.2
  Top 2: U$4.VMOT 15.23,65.73 16,66.5
  Top 2.5: 85.8,65.5 85.55,65.75 84.24,65.75 83,66.99 73.5,66.99 64,66.99 57.5,66.99 48.5,66.99 42.5,66.99 28.99,66.99 28.5,66.5 16,66.5
  Top 3: X1.3 85.02,42.42 87,44.4 87,64.3 85.8,65.5
+12V/2
  Top 0.4: R25.2 81.46,24.5 H0.2
  pour Top (rank 3, no thermals): 78.5,34 78.5,34.5 86.5,34.5 86.5,21 79.5,21 79,21 78.5,21
AB1-4
  Bottom 1.5: M4B.4 27.81,65.19 25.27,67.73 M4A.3
AB2-4
  Bottom 1.5: M4B.1 20.19,65.19 22.73,67.73 M4A.2
AREF
  Top 0.3: IC3.98 47,30.25 C22.1
DIR1
  Top 0.2: IC3.78 57,30.11 62.29,35.39 62.29,41.83 65.57,45.12 U$1.DIR
DIR2
  Top 0.2: U$2.DIR 54,43.56 IC3.84
DIR3
  Top 0.2: IC3.87 52.5,33.66 42.33,43.83 42.21,43.94 39.17,46.99 U$3.DIR
DIR4
  Top 0.2: U$4.DIR 36.54,43.54 39.5,43.54 41.38,43.54 42.05,43.54 52,33.59 IC3.88
DTR
  Top 0.2: IC4.13 24.6,17.75 C10.1 R15.1
EN1
  Top 0.2: U$1.EN 68.9,61.44 68.9,47.31 63.09,41.5 63.09,35.06 58,29.97 IC3.76
EN2
  Top 0.2: IC3.82 55,60.34 U$2.EN
EN3
  Top 0.2: U$3.EN 38.9,61.44 38.9,48.39 42.54,44.74 53.5,33.79 IC3.85
EN4
  Top 0.2: IC3.94 49,33.2 47.54,34.66 17.49,34.66 15.23,36.91 U$4.EN
FAN1  (1 unrouted)
FAN1_D
  Top 1: FAN1.2 4.23,62.73 6.33,64.83 6.33,67.88 6.75,68.3 10.42,68.3 12.5,70.38 Q5.D
FAN1_G  (1 unrouted)
FAN1_V
  Bottom 1: JP1.2 7,64 5.73,65.27 FAN1.1
FAN2  (1 unrouted)
FAN2_D
  Top 1: FAN2.2 5.4,52.83 Q6.D
FAN2_G  (1 unrouted)
FAN2_V
  Bottom 1: JP2.2 7,56 5.73,57.27 FAN2.1
GND  (via drill 0.4)  (27 unrouted)
  Top 0.2: IC4.3 19.25,16.75 IC4.33 | IC3.32 49,9.65 C18.2
  Top 0.3: C22.2 46,32.35 C21.2 45.7,29.65 46.32,29.65 46.5,29.47 IC3.99 | IC3.81 55.5,31.85 C20.2 | R7.1 66.51,50.15 66.03,50.63 65.11,50.63 64.47,49.99 64.47,48.19 U$2.GND | R8.1 51.51,50.15 51.03,50.63 50.11,50.63 49.47,49.99 49.47,48.19 U$3.GND | R9.1 36.51,50.15 36.03,50.63 35.11,50.63 33.98,49.5 R10.1 29.85,48.01 29.37,47.53 29.37,46.61 32.5,43.48 STOP2.3 | C7.- v18,52.5 | v18,52.5 v18,54.5 | v18,52.5 v18,50.5
  Top 0.4: T1.2 3.92,35.65 C13.2 | T2.2 3.92,41.65 C16.2 | T0.2 3.92,29.65 C12.2
  Top 0.5: R2.1 78.93,33.85 X1.2 | U$1.GND@0 81.91,62.23 X1.7
  Top 1: U$3.GND@0 45.64,59.6 | 45.64,59.6 C6.- | U$3.GND 45.64,49.62 45.64,59.6 | U$2.GND@0 60.64,59.6 | 60.64,59.6 C5.- | U$2.GND 60.64,49.62 60.64,59.6
  Bottom 0.2: GROUND.2 9,10.5
  Bottom 2: Q4.S 74.27,12.31 74.27,21.27 75.54,22.54 Q3.S
  other vias: 46.5,42.5 48.5,42.5 50.5,42.5 52.5,42.5
  pour Bottom (no thermals): 75,21.5 80,21.5 80,24.5 80.5,25 89.5,25 89.5,39.5 78.5,39.5 78.5,34 78.5,28.5 77,27 76,26 75,26
  pour Bottom (rank 6): -1,74.5 90.5,74.5 90.5,65 90.5,-1 84.5,-1 -1,-1 -1,5
  pour Top (rank 6): 14,66.5 79.5,66.5 79.5,58.5 79.5,41 65,41 14,41
H0_D
  Top 0.4: LED1.C 72.95,20 Q3.D
  pour Top (no thermals): 75,21.5 75,18.5 78.5,18.5 79.5,17.5 80.5,16.5 82,16.5 86.5,16.5 86.5,21 80.5,21 80,21.5
H0_G
  Top 0.4: R23.2 77.04,17.5 Q3.G
H0_LED
  Top 0.4: LED1.A 71.65,23.4 R25.1
H1_D
  Top 0.4: LED2.C 73.45,7 Q4.D
  Top 2: Q4.D 79.88,7 H1.1
H1_G
  Top 0.4: R26.2 77,4.5 Q4.G
H1_LED
  Top 0.4: LED2.A 72.5,11.15 R27.1
HEATER0  (1 unrouted)
  Top 0.2: R24.1 R23.1
HEATER1  (1 unrouted)
  Top 0.2: R28.1 R26.1
M8RXD
  Top 0.2: R21.2 28.35,12.5 25.1,12.5 22.45,15.15 IC4.9
M8TXD
  Top 0.2: IC4.8 25.15,11.65 R20.2
MISO  (1 unrouted)
MISO2
  Top 0.2: IC4.17 21.75,26.61 22.53,27.39 24.41,27.39 ICSP1.1
MOSI  (1 unrouted)
MOSI2
  Top 0.2: IC4.16 22.45,23.18 ICSP1.4
N$1  (1 unrouted)
N$2  (1 unrouted)
RD_N
  Top 0.2: IC4.30 17.12,16.76 17.08,16.8 16.57,16.8 16.07,16.3 13.15,16.3 R12.2
RD_P
  Top 0.2: R13.2 13.9,16.8 14,16.7 15.9,16.7 16.4,17.2 17.08,17.2 17.12,17.24 IC4.29
RX_L
  Top 0.2: RX.A 28.45,14.5 R17.1
RXD
  Top 0.2: R21.1 32,13.85 32,23.5 34.5,26 IC3.2
RXL
  Top 0.2: RX.C 24.95,14.8 23.5,16.25 IC4.10
SCK  (1 unrouted)
SCK2
  Top 0.2: IC4.15 22.88,18.76 24.12,20.01 24.12,25.14 ICSP1.3
STEP1
  Top 0.2: IC3.77 57.5,30.04 62.69,35.23 62.69,41.67 66.62,45.6 66.62,48.48 U$1.STEP
STEP2
  Top 0.2: IC3.83 54.5,45.6 U$2.STEP
STEP3
  Top 0.2: IC3.86 53,33.72 37.42,49.3 35.8,49.3 U$3.STEP
STEP4
  Top 0.2: U$4.STEP 34.4,43.14 39.5,43.14 41.21,43.14 41.88,43.14 51.4,33.63 51.4,32.95 51.5,32.85 IC3.89
STOP1
  Top 0.2: STOP1.1 47.5,36.96 51,33.46 IC3.90
STOP2
  Top 0.2: STOP2.1 33.6,35.86 48.04,35.86 50.5,33.39 IC3.91
STOP3
  Top 0.2: IC3.92 50,33.33 47.87,35.46 26.5,35.46 STOP3.1
STOP4  (1 unrouted)
  Top 0.2: IC3.93 49.5,33.26 47.71,35.06 19.4,35.06 STOP4.1
TH_0
  Top 0.2: R18.1 13.11,33.46 47.04,33.46 47.5,33 IC3.97
  Top 0.4: T0.1 3.92,31.35 C12.1 R18.1
TH_1
  Top 0.2: IC3.96 48,33.07 47.21,33.86 14.49,33.86 R19.1
  Top 0.4: T1.1 3.92,37.35 C13.1 R19.1
TH_2
  Top 0.2: IC3.95 48.5,33.13 47.38,34.26 14.66,34.26 11.9,37.02 11.9,42.45 R22.1
  Top 0.4: T2.1 3.92,43.35 C16.1 R22.1
TX_L
  Top 0.2: TX.A 28.55,16.5 R16.1
TXD
  Top 0.2: R20.1 27.35,11 30.7,11 32.4,12.71 32.4,23.33 34.57,25.5 IC3.3
TXL
  Top 0.2: IC4.11 24.7,16.75 TX.C
UGND  (3 unrouted)
  Top 0.2: IC4.28 16.4,17.75 C11.2
USB_N  (1 unrouted)
  Top 0.2: X2.2 9.96,20.5 12.1,20.5 12.4,20.2 12.4,19.95 R12.1
USB_P  (1 unrouted)
  Top 0.2: X2.3 8.36,20.9 12.27,20.9 13.82,19.35 R13.1
USHIELD  (4 unrouted)
UVCC  (3 unrouted)
UVCC_G
  Top 0.5: R3.2 67.95,37.9 67.95,39.45 | R4.2 68.85,40.35 67.95,39.45 | Q2.G 66.36,41.04 67.95,39.45
VUCAP
  Top 0.2: C11.1 16,19.8 16.85,18.95 16.85,18.53 17.12,18.26 IC4.27
XT1
  Top 0.2: Y1.2 15.96,10.89 C14.1 R11.1 18.25,11.6 IC4.1
XT2
  Top 0.2: Y1.1 21.04,10.89 C15.1 R11.2 18.75,11.6 IC4.2
XTAL1
  Top 0.2: IC3.34 50,10.98 50.52,10.46 50.52,7.83 R6.1 C2.2 52.54,7.39 Y2.2
XTAL2
  Top 0.2: IC3.33 49.5,10.92 50.12,10.29 50.12,8.47 R6.2 C1.2 47.46,7.39 Y2.1
XVCC  (1 unrouted)